# EAGLE design Lab11 with Breakouts (EAGLE 9.3.0)

## Sheet 1 of 5: ESP32
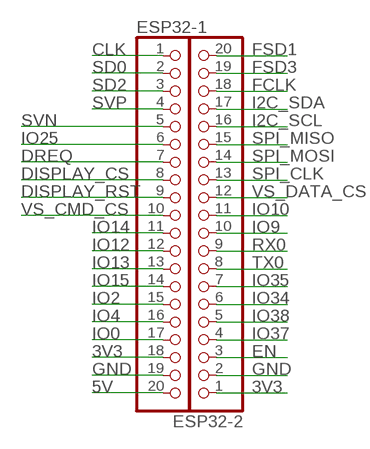
[diagram p0: schematic, sheet 1]

### Parts
ESP32-1  PINHD-1X20  [1X20]
ESP32-2  PINHD-1X20  [1X20]

### Nets
3V3: ESP32-1.18 ESP32-2.1 ; also sheet 2,3,5
5V: ESP32-1.20
CLK: ESP32-1.1
DISPLAY_CS: ESP32-1.8 ; also sheet 3
DISPLAY_RST: ESP32-1.9 ; also sheet 3
DREQ: ESP32-1.7 ; also sheet 2
EN: ESP32-2.3
FCLK: ESP32-2.18
FSD1: ESP32-2.20
FSD3: ESP32-2.19
GND: ESP32-1.19 ESP32-2.2 ; also sheet 2,3,4,5
I2C_SCL: ESP32-2.16
I2C_SDA: ESP32-2.17
IO0: ESP32-1.17
IO2: ESP32-1.15 ; also sheet 4
IO4: ESP32-1.16 ; also sheet 4
IO9: ESP32-2.10 ; also sheet 3
IO10: ESP32-2.11 ; also sheet 5
IO12: ESP32-1.12 ; also sheet 4
IO13: ESP32-1.13 ; also sheet 4
IO14: ESP32-1.11 ; also sheet 4
IO15: ESP32-1.14 ; also sheet 4
IO25: ESP32-1.6 ; also sheet 5
IO34: ESP32-2.6
IO35: ESP32-2.7
IO37: ESP32-2.4 ; also sheet 5
IO38: ESP32-2.5 ; also sheet 5
RX0: ESP32-2.9
SD0: ESP32-1.2
SD2: ESP32-1.3
SPI_CLK: ESP32-2.13 ; also sheet 2,3
SPI_MISO: ESP32-2.15 ; also sheet 2,3
SPI_MOSI: ESP32-2.14 ; also sheet 2,3
SVN: ESP32-1.5
SVP: ESP32-1.4 ; also sheet 5
TX0: ESP32-2.8
VS_CMD_CS: ESP32-1.10 ; also sheet 2
VS_DATA_CS: ESP32-2.12 ; also sheet 2

## Sheet 2 of 5: VS1053
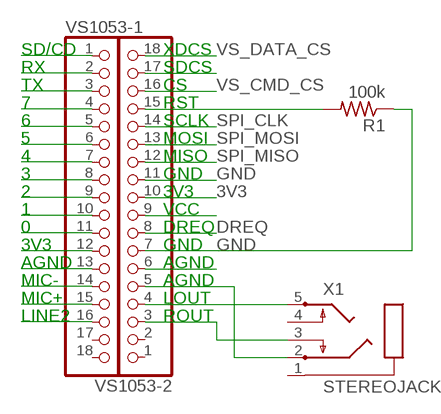
[diagram p1: schematic, sheet 2]

### Parts
R1  100k  R-US_0204/2V  [0204V]
VS1053-1  PINHD-1X18  [1X18]
VS1053-2  PINHD-1X18  [1X18]
X1  STEREOJACK  [STX3100]

### Nets
3V3: VS1053-2.10 ; also sheet 1,3,5
DREQ: VS1053-2.8 ; also sheet 1
GND: R1.1 VS1053-2.7 VS1053-2.11 ; also sheet 1,3,4,5
N$1: VS1053-1.9 VS1053-2.4 X1.5
N$2: VS1053-1.1
N$3: VS1053-1.2
N$4: VS1053-1.3
N$5: VS1053-1.4
N$6: VS1053-1.5
N$7: VS1053-1.6
N$8: VS1053-1.7
N$9: VS1053-1.8
N$10: VS1053-1.10
N$11: VS1053-1.11
N$12: VS1053-1.12
N$13: VS1053-1.13
N$14: VS1053-1.14
N$15: VS1053-1.15
N$16: VS1053-1.16
N$17: VS1053-2.3 X1.3
N$18: VS1053-2.17
N$20: R1.2 VS1053-2.15
N$26: VS1053-2.9
N$29: VS1053-2.6
N$30: VS1053-2.5 X1.2
SPI_CLK: VS1053-2.14 ; also sheet 1,3
SPI_MISO: VS1053-2.12 ; also sheet 1,3
SPI_MOSI: VS1053-2.13 ; also sheet 1,3
VS_CMD_CS: VS1053-2.16 ; also sheet 1
VS_DATA_CS: VS1053-2.18 ; also sheet 1
Unconnected: VS1053-1.17 VS1053-1.18 VS1053-2.1 VS1053-2.2 X1.1 X1.4

### Notes on the sheet
- SD/CD | XDCS
- RX | SDCS
- TX | CS
- 7 | RST
- 6 | SCLK
- 5 | MOSI
- 4 | MISO
- 3 | GND
- 2 | 3V3
- 1 | VCC
- 0 | DREQ
- 3V3 | GND
- AGND | AGND
- MIC- | AGND
- MIC+ | LOUT
- LINE2 | ROUT

## Sheet 3 of 5: DISPLAY
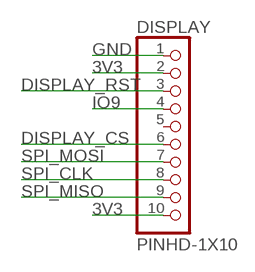
[diagram p2: schematic, sheet 3]

### Parts
DISPLAY  PINHD-1X10  [1X10-BIG]

### Nets
3V3: DISPLAY.2 DISPLAY.10 ; also sheet 1,2,5
DISPLAY_CS: DISPLAY.6 ; also sheet 1
DISPLAY_RST: DISPLAY.3 ; also sheet 1
GND: DISPLAY.1 ; also sheet 1,2,4,5
IO9: DISPLAY.4 ; also sheet 1
SPI_CLK: DISPLAY.8 ; also sheet 1,2
SPI_MISO: DISPLAY.9 ; also sheet 1,2
SPI_MOSI: DISPLAY.7 ; also sheet 1,2
Unconnected: DISPLAY.5

## Sheet 4 of 5: SD CARD
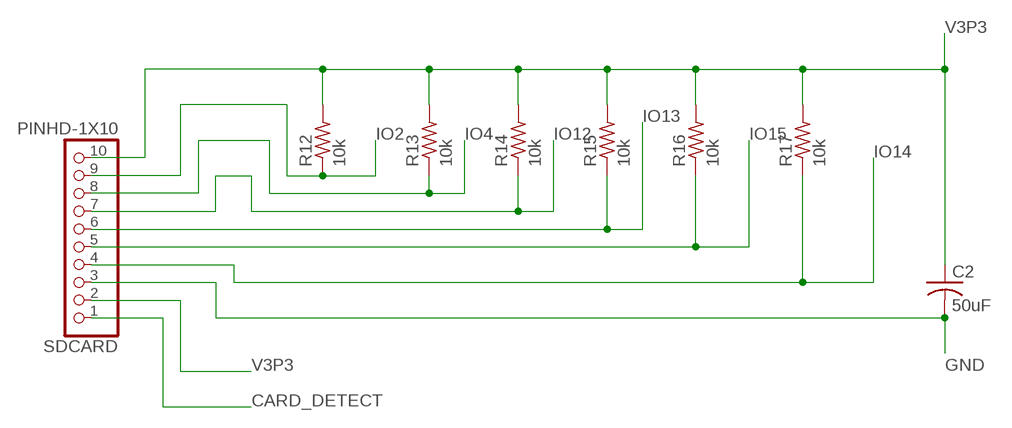
[diagram p3: schematic, sheet 4]

### Parts
C2  50uF  C-US025-024X044  [C025-024X044]
R12  10k  R-US_0204/2V  [0204V]
R13  10k  R-US_0204/2V  [0204V]
R14  10k  R-US_0204/2V  [0204V]
R15  10k  R-US_0204/2V  [0204V]
R16  10k  R-US_0204/2V  [0204V]
R17  10k  R-US_0204/2V  [0204V]
SDCARD  PINHD-1X10  [1X10-BIG]

### Nets
CARD_DETECT: SDCARD.1
GND: C2.2 SDCARD.3 ; also sheet 1,2,3,5
IO2: R12.1 SDCARD.9 ; also sheet 1
IO4: R13.1 SDCARD.8 ; also sheet 1
IO12: R14.1 SDCARD.7 ; also sheet 1
IO13: R15.1 SDCARD.6 ; also sheet 1
IO14: R17.1 SDCARD.4 ; also sheet 1
IO15: R16.1 SDCARD.5 ; also sheet 1
V3P3: C2.1 R12.2 R13.2 R14.2 R15.2 R16.2 R17.2 SDCARD.2 SDCARD.10

## Sheet 5 of 5: BUTTONS
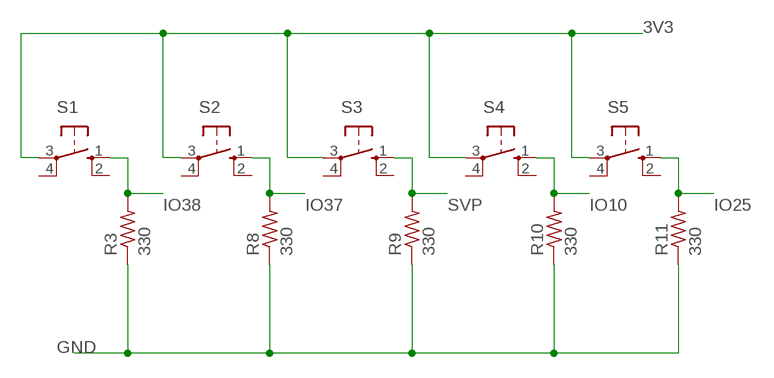
[diagram p4: schematic, sheet 5]

### Parts
R3  330  R-US_0204/2V  [0204V]
R8  330  R-US_0204/2V  [0204V]
R9  330  R-US_0204/2V  [0204V]
R10  330  R-US_0204/2V  [0204V]
R11  330  R-US_0204/2V  [0204V]
S1  10-XX  [B3F-10XX]
S2  10-XX  [B3F-10XX]
S3  10-XX  [B3F-10XX]
S4  10-XX  [B3F-10XX]
S5  10-XX  [B3F-10XX]

### Nets
3V3: S1.3(P) S2.3(P) S3.3(P) S4.3(P) S5.3(P) ; also sheet 1,2,3
GND: R3.1 R8.1 R9.1 R10.1 R11.1 ; also sheet 1,2,3,4
IO10: R10.2 S4.1(S) ; also sheet 1
IO25: R11.2 S5.1(S) ; also sheet 1
IO37: R8.2 S2.1(S) ; also sheet 1
IO38: R3.2 S1.1(S) ; also sheet 1
SVP: R9.2 S3.1(S) ; also sheet 1
Unconnected: S1.2(S1) S1.4(P1) S2.2(S1) S2.4(P1) S3.2(S1) S3.4(P1) S4.2(S1) S4.4(P1) S5.2(S1) S5.4(P1)

## Library data of the parts
C2 = adafruit:C-US: CAPACITOR, American symbol
DISPLAY SDCARD = adafruit:PINHD-1X10: Pin header 1x10 0.1" spacing With round pins
ESP32-1 ESP32-2 = adafruit:PINHD-1X20: PIN HEADER
R1 R3 R8-R17 = adafruit:R-US_: RESISTOR, American symbol
S1-S5 = switch-omron:10-XX: OMRON SWITCH; MPN: B3F-1000; OC_FARNELL: 176432; OC_NEWARK: 36M3542
VS1053-1 VS1053-2 = adafruit:PINHD-1X18: PIN HEADER
X1 = adafruit:STEREOJACK: MIC/HEADPHONE JACK Stereo jack with two switches. Kycon STX3100, CUI SJ1-3555NG and/or 4UCon 05544

## Board
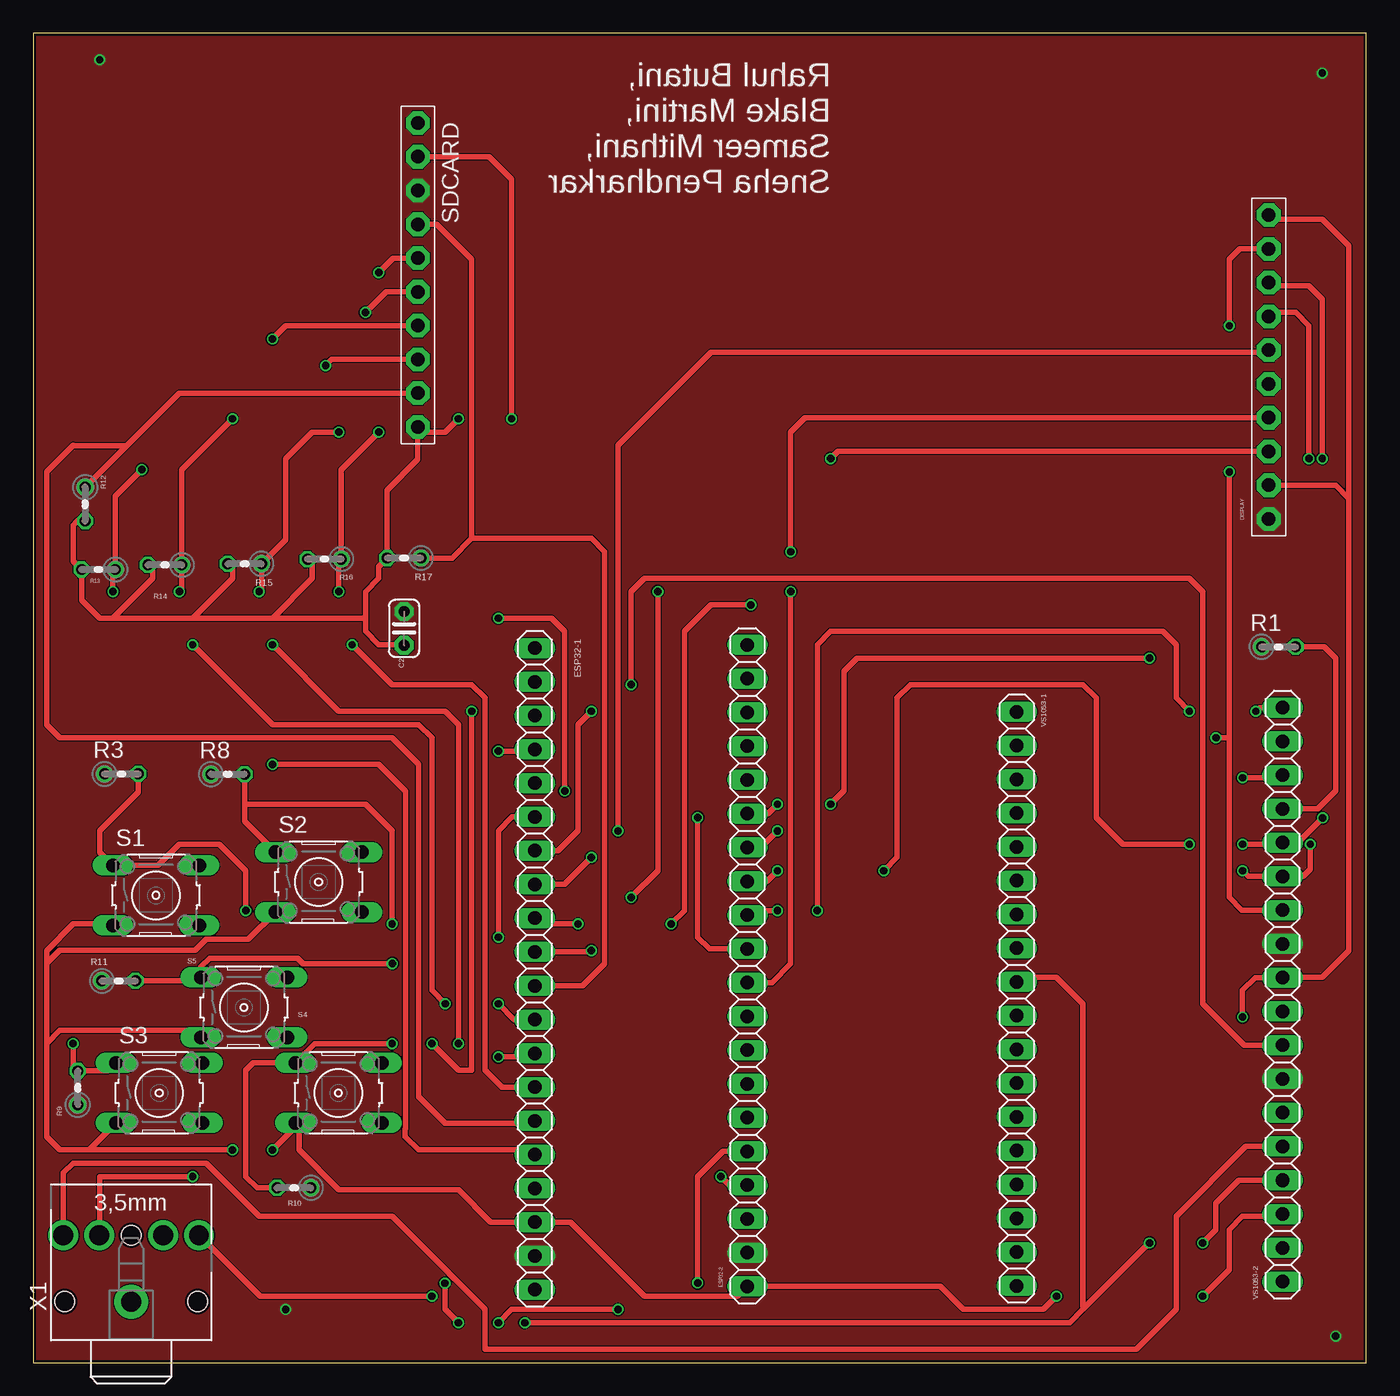
[diagram p5: board, top side]
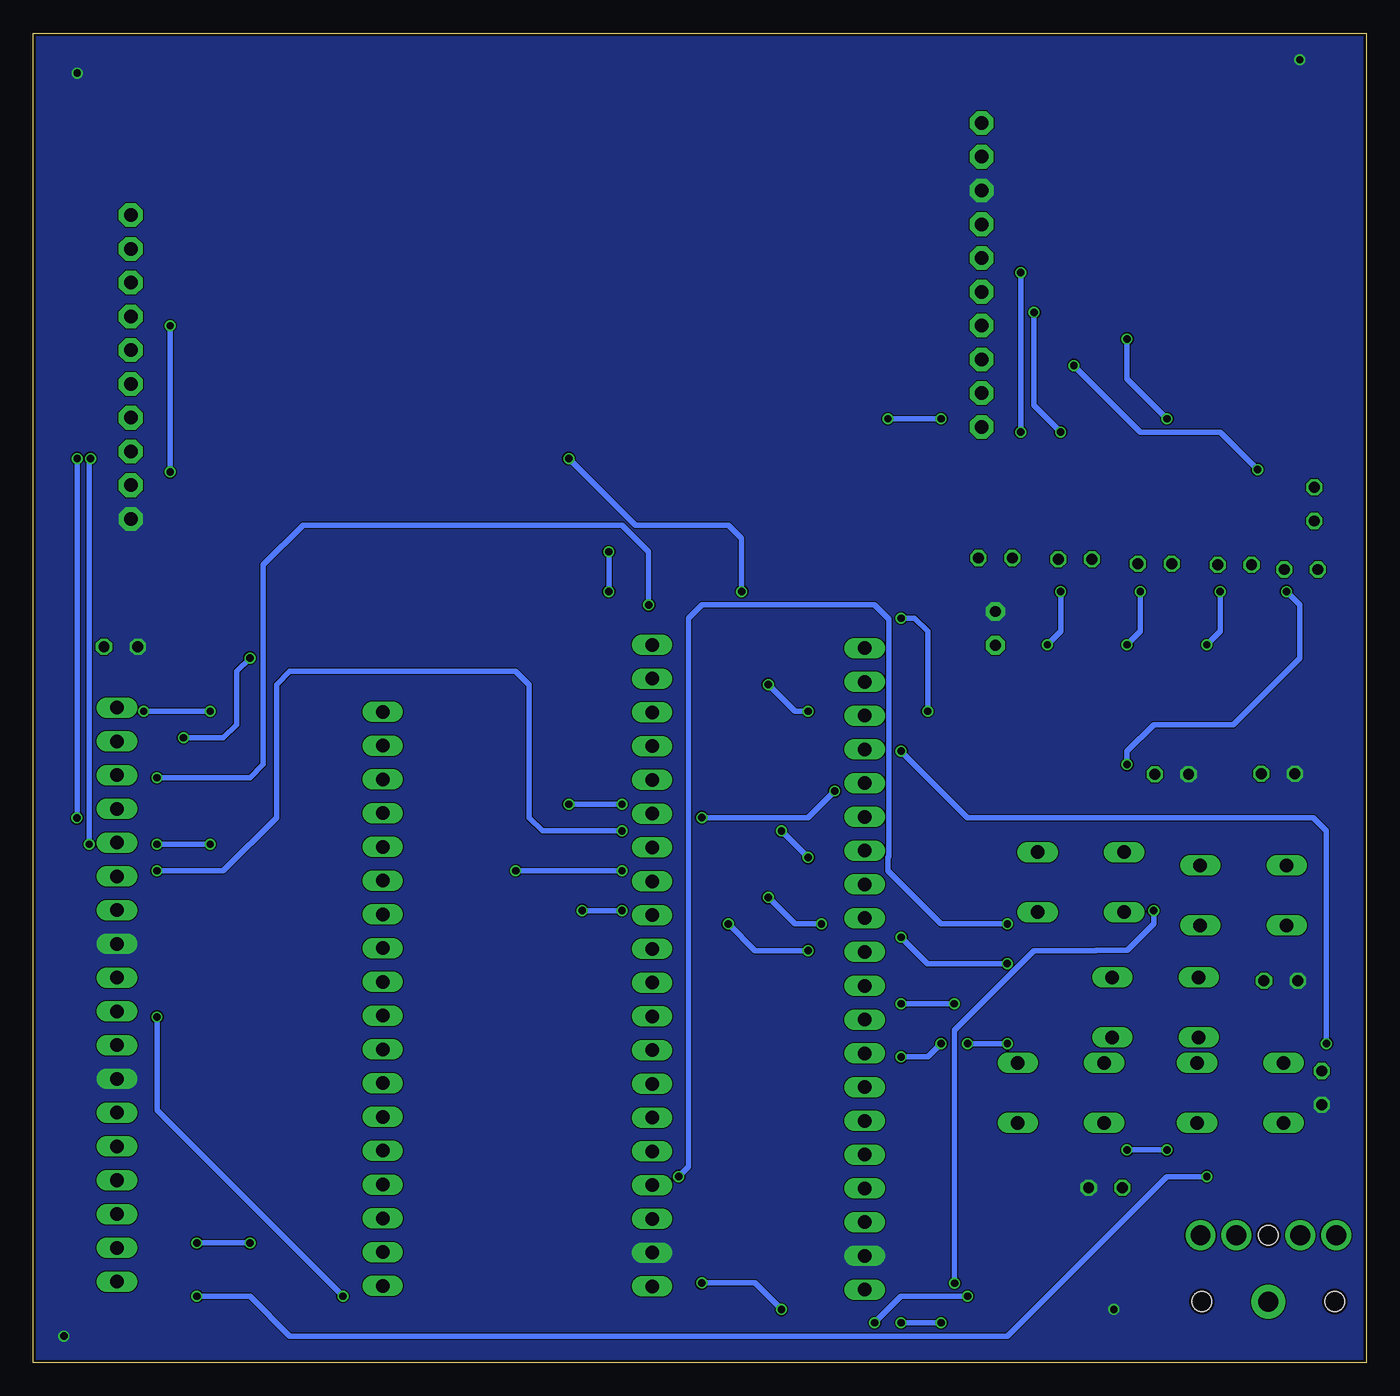
[diagram p6: board, bottom side, seen from below]

Size 100.31 x 100 mm. Coordinates in mm from the lower left corner, seen from the top.
Outline: 0,0 100.31,0 100.31,100 0,100 0,0
Copper layers (1*16): Top 0.035mm / dielectric 1.5mm / Bottom 0.035mm
Design rules "jlcpcb": minimum track width 3.5mil, minimum drill 0.2mm, track to track 3.5mil, track to pad 3.5mil, pad to pad 6mil, via to via 6mil, smd to smd 6mil, copper to edge 0.2mm, drill to drill 0.2mm, minimum pad ring 3mil, minimum via ring 3mil, stop-mask expansion 4mil, vias tented up to drill 0mil, thermal gap 10mil

### Footprints (pad centres in the part's own frame; a part is rotated, then mirrored left to right if it is on the bottom)
C025-024X044 = drill 0.813 pad 1.422 octagon: 1 -1.27,0; 2 1.27,0
1X10-BIG = drill 1.016 pad 1.778 octagon: 1 -11.43,0; 2 -8.89,0; 3 -6.35,0; 4 -3.81,0; 5 -1.27,0; 6 1.27,0; 7 3.81,0; 8 6.35,0; 9 8.89,0; 10 11.43,0
1X20 = drill 1.016 long: 1 -24.13,0; 2 -21.59,0; 3 -19.05,0; 4 -16.51,0; 5 -13.97,0; 6 -11.43,0; 7 -8.89,0; 8 -6.35,0; 9 -3.81,0; 10 -1.27,0; 11 1.27,0; 12 3.81,0; 13 6.35,0; 14 8.89,0; 15 11.43,0; 16 13.97,0; 17 16.51,0; 18 19.05,0; 19 21.59,0; 20 24.13,0
0204V = drill 0.813 octagon: 1 -1.27,0; 2 1.27,0
B3F-10XX = drill 1.016 long: 1 -3.251,2.261; 2 3.251,2.261; 3 -3.251,-2.261; 4 3.251,-2.261
1X18 = drill 1.016 long: 1 -21.59,0; 2 -19.05,0; 3 -16.51,0; 4 -13.97,0; 5 -11.43,0; 6 -8.89,0; 7 -6.35,0; 8 -3.81,0; 9 -1.27,0; 10 1.27,0; 11 3.81,0; 12 6.35,0; 13 8.89,0; 14 11.43,0; 15 13.97,0; 16 16.51,0; 17 19.05,0; 18 21.59,0
STX3100 = drill 1.5 pad 2.54: 1 2.7,-0.1 | drill 1.5: 2 7.7,5; 3 7.7,2.3; 4 7.7,-2.5; 5 7.7,-5.2 | hole 1.5: 2.7,4.9; 2.7,-5.1; 7.7,-0.1

### Placement (x,y rotation side)
C2  27.91,55.23 90 top
DISPLAY  92.97,74.89 90 top
ESP32-1  37.74,29.62 270 top
ESP32-2  53.74,29.86 90 top
R1  93.71,53.85 0 top
R3  6.64,44.29 0 top
R8  14.64,44.26 0 top
R9  3.35,20.67 90 top
R10  19.62,13.15 180 top
R11  6.43,28.72 0 top
R12  3.91,64.58 270 top
R13  4.91,59.66 180 top
R14  9.91,60.01 180 top
R15  15.91,60.09 180 top
R16  21.91,60.44 180 top
R17  27.91,60.52 180 top
S1  9.24,35.15 0 top
S2  21.48,36.15 0 top
S3  9.48,20.29 0 top
S4  22.97,20.29 0 top
S5  15.86,26.72 0 top
SDCARD  28.94,81.82 270 top
VS1053-1  74.01,27.37 270 top
VS1053-2  94.01,27.69 90 top
X1  7.27,1.89 90 top

### Tracks (layer width: path | path; a pad name or v marks a point on that pad's centre or on a via)
3V3  (via drill 0.55)
  Top 0.4: S5.3 12.07,25 2,25 1,24 | 4.2,16 S3.3 | 4.2,16 v15,16 | v18,16 19.72,17.72 S4.3 20,17.75 20,16 23,13 32,13 34.43,10.57 ESP32-1.18 40.43,10.57 46,5 53.01,5 ESP32-2.1 68.27,5.73 70,4 76,4 v77,5 | S1.3 5.88,33 3,33 1,31 1,30.03 | 1,30.03 1,24 | S2.3 16.18,31.84 13,31.84 12.19,31.03 2,31.03 1,30.03 | 99,65 98,66 DISPLAY.2 | 99,65 99,31 97,29 94.05,29 VS1053-2.10 91.96,28.96 91,28 v91,26 | DISPLAY.10 93.29,86 97,86 99,84 99,65 | 1,24 1,17 2,16 4.2,16
  Bottom 0.4: v15,16 v18,16 | v77,5 91,19 v91,26
DISPLAY_CS  (via drill 0.55)
  Top 0.4: DISPLAY.6 92.81,76 51,76 44,69 v44,40 | v42,38 39.97,35.97 ESP32-1.8
  Bottom 0.4: v44,40 v42,38
DISPLAY_RST  (via drill 0.55)
  Top 0.4: DISPLAY.3 60.54,68.54 v60,68 | v47,58 47,37 v45,35 | v41,33 38.17,33 ESP32-1.9
  Bottom 0.4: v60,68 55,63 48,63 47,62 v47,58 | v45,35 43,33 v41,33
DREQ  (via drill 0.55)
  Top 0.4: VS1053-2.8 91.12,23.88 88,27 88,58 87,59 46,59 45,58 v45,51 | v42,49 41,48 41,40 39.51,38.51 ESP32-1.7
  Bottom 0.4: v45,51 43,49 v42,49
GND  (via drill 0.55)
  other vias: 5,98 19,4 98,2 97,97
  pour Top (rank 2, no thermals): 0,100 100.2,100 100.2,0 0,0
  pour Bottom (rank 2, no thermals): 0,100 100.2,100 100.2,0 0,0
IO2
  Top 0.4: R12.1 7.03,68.97 | 7.03,68.97 10.99,72.93 SDCARD.9 | 7.03,68.97 3.03,68.97 3,69 1,67 1,48 2,47 27,47 29,45 29,20 31,18 37.55,18 ESP32-1.15
IO4  (via drill 0.55)
  Top 0.4: SDCARD.8 22.47,75.47 v22,75 | v8.18,67.18 6.18,65.18 R13.1 6,59.48 v6,58 | v18,45 26,45 28.03,42.97 28.03,17.59 28,17.56 28,17 29,16 37.39,16 ESP32-1.16
  Bottom 0.4: v22,75 17,70 11,70 v8.18,67.18 | v6,58 5,57 5,53 10,48 16,48 18,46 v18,45
IO9  (via drill 0.55)
  Top 0.4: DISPLAY.4 58.08,71.08 57,70 v57,61 | v57,58 57,30 55.59,28.59 ESP32-2.10
  Bottom 0.4: v57,61 v57,58
IO10  (via drill 0.55)
  Top 0.4: R10.2 16.85,13.15 16,14 16,22 16.55,22.55 S4.1 21.17,24 v27,24 | v30,24 32,22 33,22 v33,49 | v35,56 39,56 40,55 v40,43 | v50,41 50,32 50.87,31.13 ESP32-2.11
  Bottom 0.4: v27,24 v30,24 | v33,49 33,55 34,56 v35,56 | v40,43 42,41 v50,41
IO12  (via drill 0.55)
  Top 0.4: v15,71 11.18,67.18 R14.1 11.18,58.18 v11,58 | v18,77 19.01,78.01 SDCARD.7 | v12,54 18,48 29,48 30,47 30,28 v31,27 | ESP32-1.12 36.19,25.81 v35,27
  Bottom 0.4: v15,71 18,74 v18,77 | v11,58 11,55 v12,54 | v31,27 v35,27
IO13  (via drill 0.55)
  Top 0.4: v23,70 21,70 19,68 19,61.91 R15.1 17.18,58.18 v17,58 | v25,79 26.55,80.55 SDCARD.6 | v18,54 23,49 31,49 32,48 v32,24 | ESP32-1.13 37.47,23 v35,23
  Bottom 0.4: v23,70 25,72 v25,79 | v17,58 17,55 v18,54 | v32,24 33,23 v35,23
IO14
  Top 0.4: R17.1 31.52,60.52 33,62 | 33,62 33,83 30.37,85.63 SDCARD.4 | 33,62 42,62 43,61 43,30 41.35,28.35 ESP32-1.11
IO15  (via drill 0.55)
  Top 0.4: v26,70 23.18,67.18 R16.1 23,60.26 v23,58 | v26,82 27.09,83.09 SDCARD.5 | v24,54 27,51 33,51 34,50 34,22 35.27,20.73 ESP32-1.14
  Bottom 0.4: v26,70 v26,82 | v23,58 23,55 v24,54
IO25  (via drill 0.55)
  Top 0.4: R11.2 12.35,28.72 S5.1 12.61,29.78 13.26,30.43 19.91,30.43 20.32,30.02 v27.02,30.02 | v35,32 35,40 36.05,41.05 ESP32-1.6
  Bottom 0.4: v27.02,30.02 33.02,30.02 v35,32
IO37  (via drill 0.55)
  Top 0.4: R8.2 15.91,42 | 15.91,42 15.91,40.73 S2.1 | 15.91,42 25,42 27,40 v27,33 | v51.74,14 52.39,13.35 ESP32-2.4
  Bottom 0.4: v27,33 32,33 36,37 36,38 35.93,38.08 35.93,55.93 37,57 50,57 51,56 51,14.74 v51.74,14
IO38  (via drill 0.55)
  Top 0.4: R3.2 7.91,42.91 5,40 5,38.4 S1.1 9.41,37.41 11,39 14,39 16,37 v16,34 | v30.98,5.98 31,5.95 31,4 v32,3 | v35,3 36,4 v44,4 | v50,6 50,14 51.89,15.89 ESP32-2.5
  Bottom 0.4: v16,34 16,33 17.97,31.03 20.31,31.03 20.34,31 25,31 31,25 31,6 v30.98,5.98 | v32,3 v35,3 | v44,4 46,6 v50,6
N$1  (via drill 0.55)
  Top 0.4: X1.5 17.06,5 v30,5 | v37,3 78,3 79,4 | VS1053-1.9 74.37,29 77,29 79,27 79,4 | 79,4 v84,9 | v88,9 89,10 89,12 90.72,13.72 VS1053-2.4
  Bottom 0.4: v30,5 35,5 v37,3 | v84,9 v88,9
N$17  (via drill 0.55)
  Top 0.4: X1.3 5,9.62 5,14 v12,14 | v88,5 90,7 90,10 91,11 93.83,11 VS1053-2.3
  Bottom 0.4: v12,14 15,14 27,2 81,2 84,5 v88,5
N$20
  Top 0.4: R1.2 97.15,53.85 98,53 98,43 96.66,41.66 VS1053-2.15
N$30
  Top 0.4: X1.2 2.27,14.27 3,15 13,15 17,11 27,11 34,4 34,1 83,1 86,4 86,11 91.26,16.26 VS1053-2.5
SPI_CLK  (via drill 0.55)
  Top 0.4: DISPLAY.8 93.21,81 96,81 97,80 v97,68 | v97.02,40.98 95.17,39.12 VS1053-2.14 93.89,39 v91,39 | v87,39 82,39 80,41 80,50 79,51 66,51 65,50 65,38 v64,37 | v56,37 55.21,36.21 ESP32-2.13
  Bottom 0.4: v97,68 97,41 v97.02,40.98 | v91,39 v87,39 | v64,37 v56,37
SPI_MISO  (via drill 0.55)
  Top 0.4: DISPLAY.9 90.78,83.78 90,83 v90,78 | v90,67 90,47 | 90,47 90,35 90.96,34.04 VS1053-2.12 | ESP32-2.15 55.29,41.29 v56,42 | v60,42 61,43 61,52 62,53 v84,53 | v89,47 90,47
  Bottom 0.4: v90,78 v90,67 | v56,42 v60,42 | v84,53 85,52 85,48 86,47 v89,47
SPI_MOSI  (via drill 0.55)
  Top 0.4: DISPLAY.7 93.27,79 95,79 96,78 v96,68 | v96.1,39 96.1,37.1 95.58,36.58 VS1053-2.13 91.42,36.58 v91,37 | v56,40 55,39 53.99,39 ESP32-2.14
  Bottom 0.4: v96,68 96.1,67.9 v96.1,39 | v91,37 86,37 82,41 82,51 81,52 64,52 63,51 63,41 62,40 v56,40
SVP  (via drill 0.55)
  Top 0.4: S3.1 5.62,21.94 R9.2 3,22.29 v3,24 | ESP32-1.4 37.61,46 v35,46
  Bottom 0.4: v35,46 30,41 4,41 3,40 v3,24
V3P3  (via drill 0.55)
  Top 0.4: R12.2 3.31,63.31 3,63 3,60.3 R13.2 3.64,57.36 5,56 6,56 | 6,56 9,59 9,59.65 R14.2 | 6,56 12,56 | 12,56 15,59 15,59.73 R15.2 | 12,56 18,56 | 18,56 21,59 21,60.08 R16.2 | 18,56 25,56 | 25,56 25,58 26,59 26,59.88 R17.2 26.64,65.64 28.94,67.94 28.94,70 | 25,56 25,55 26,54 27.87,54 C2.1 | 28.94,70 SDCARD.10 | SDCARD.2 34.29,90.71 36,89 v36,71 | v32,71 31,70 28.94,70
  Bottom 0.4: v36,71 v32,71
VS_CMD_CS  (via drill 0.55)
  Top 0.4: VS1053-2.16 93.81,44 v91,44 | v54,57 51,57 49,55 49,34 v48,33 | v42,31 41.89,30.89 ESP32-1.10
  Bottom 0.4: v91,44 84,44 83,45 83,60 80,63 56,63 54,61 v54,57 | v48,33 46,31 v42,31
VS_DATA_CS  (via drill 0.55)
  Top 0.4: VS1053-2.18 92.28,49.28 v92,49 | v87,49 86,50 86,54 85,55 60,55 59,54 v59,34 | v56,34 54.07,34 ESP32-2.12
  Bottom 0.4: v92,49 v87,49 | v59,34 v56,34

### Text on the board
tPlace: Rahul Butani, / Blake Martini, / Sameer Mithani, / Sneha Pendharkar